# Altium schematic sheet 超级系统核心原理图.SchDoc
size A3
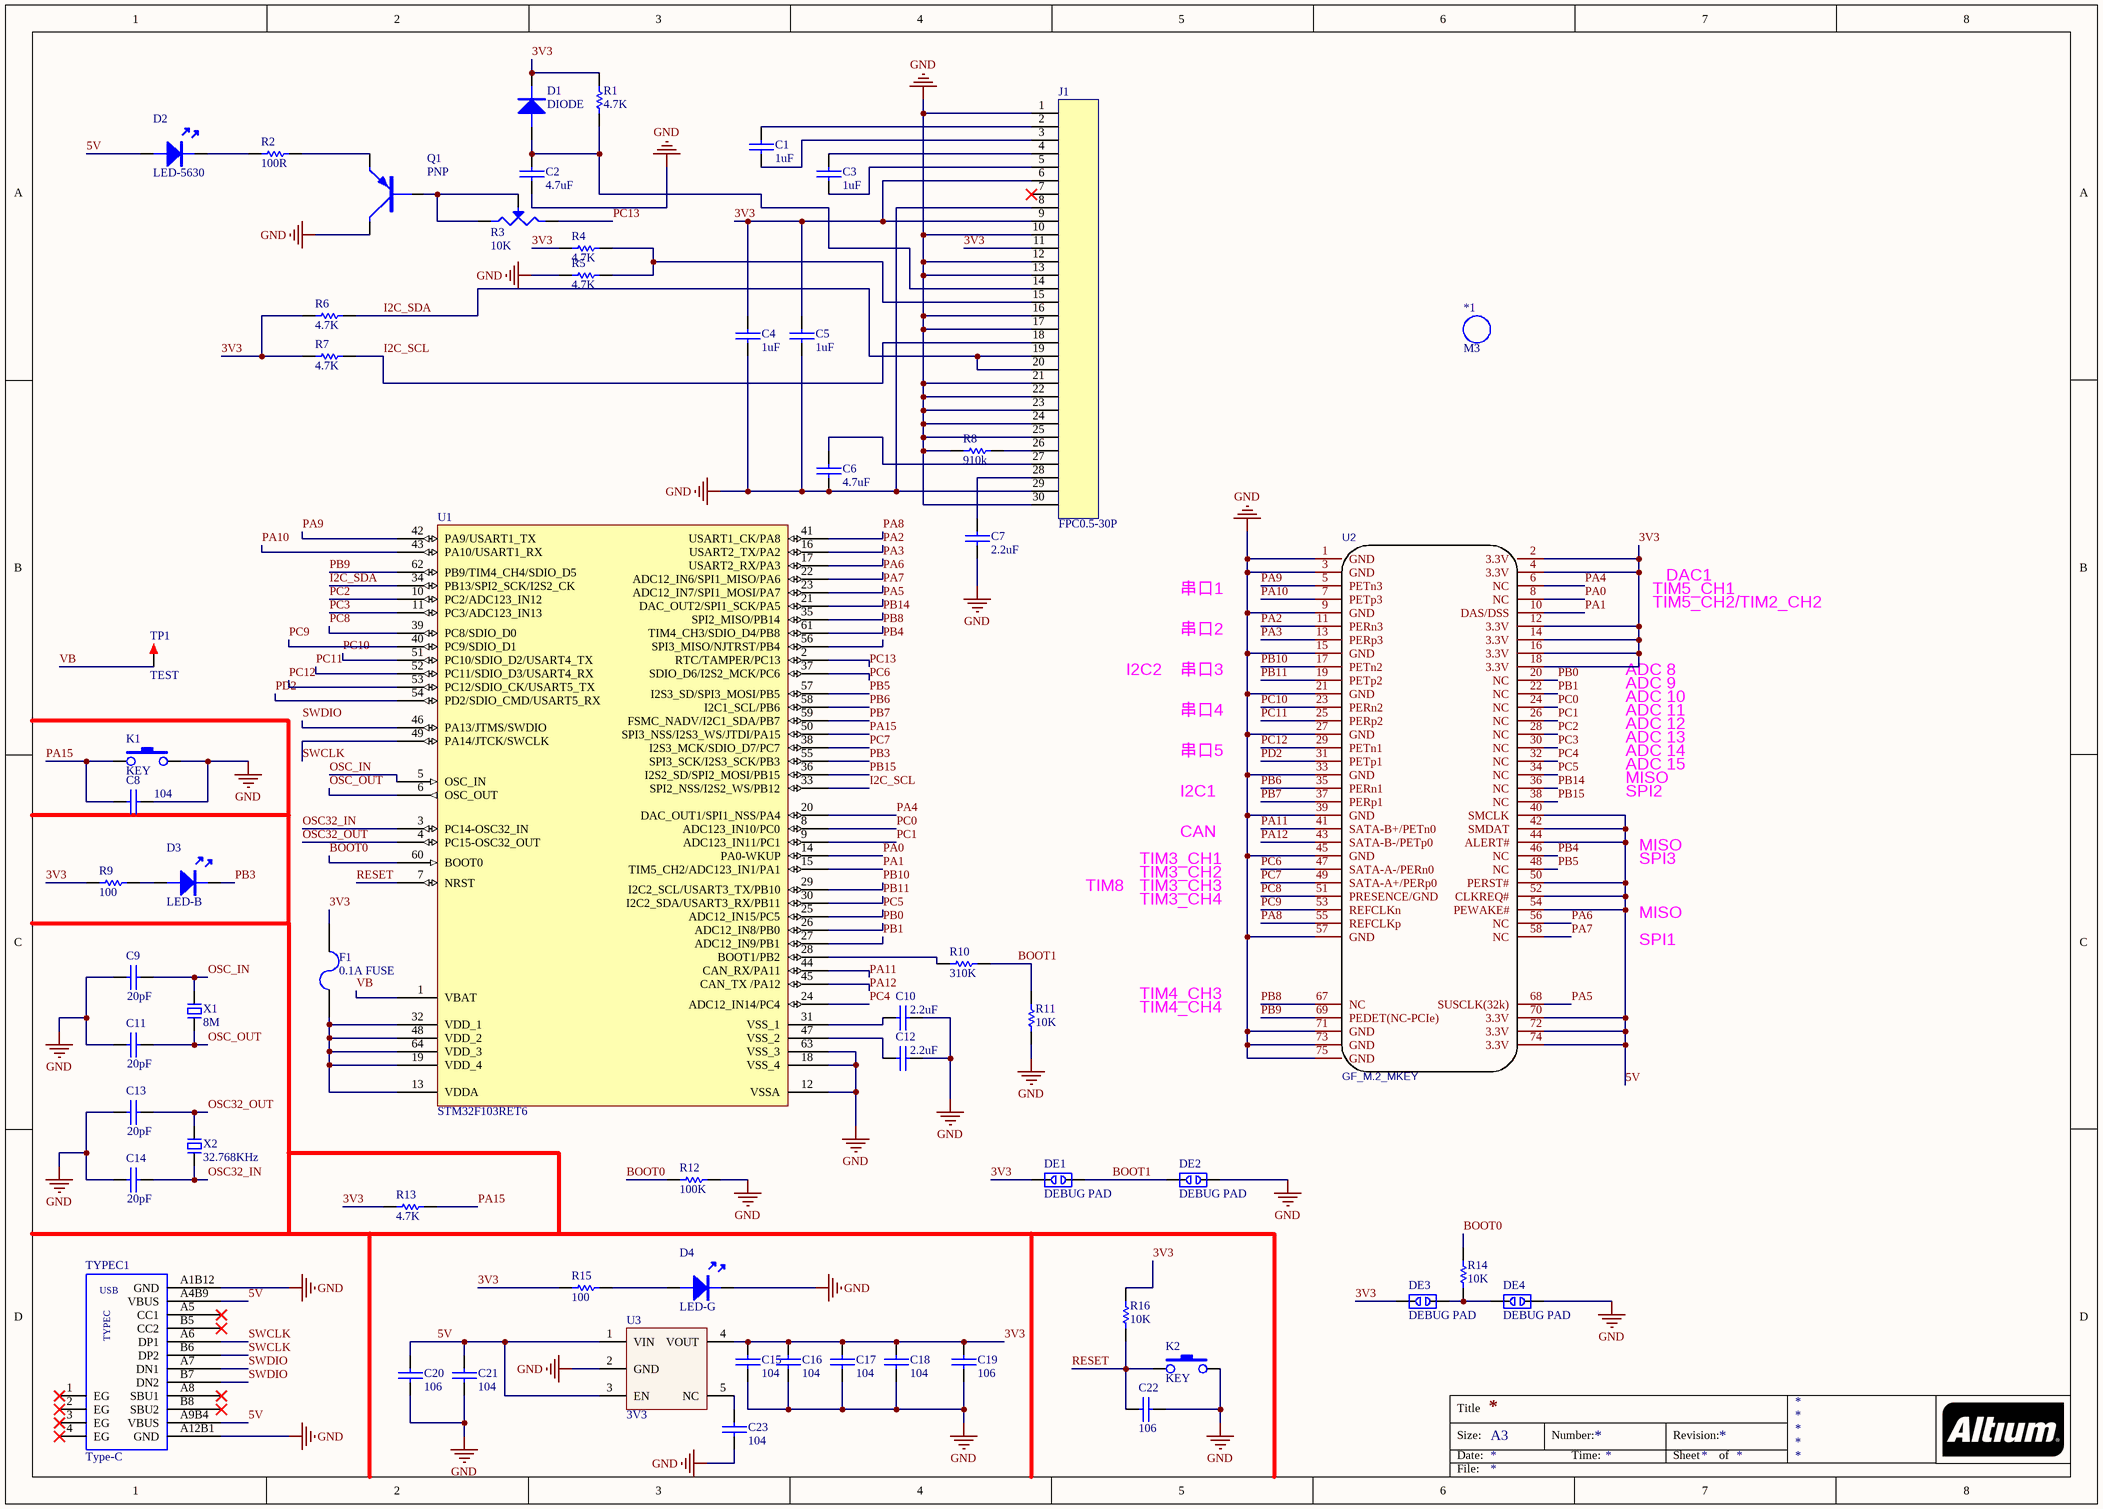
[diagram p0: 超级系统核心原理图.SchDoc]

## Parts
*1  M3  [M3 140X350]
C1  1uF  [0603C]
C2  4.7uF  [0603C]
C3  1uF  [0603C]
C4  1uF  [0603C]
C5  1uF  [0603C]
C6  4.7uF  [0603C]
C7  2.2uF  [0603C]
C8  104  [0603C]
C9  20pF  [0603C]
C10  2.2uF  [0603C]
C11  20pF  [0603C]
C12  2.2uF  [0603C]
C13  20pF  [0603C]
C14  20pF  [0603C]
C15  104  [0603C]
C16  104  [0603C]
C17  104  [0603C]
C18  104  [0603C]
C19  106  [0805C]
C20  106  [0805C]
C21  104  [0603C]
C22  106  [0805C]
C23  104  [0603C]
D1  DIODE  [SOD-523]
D2  LED-5630  [LED-5630W]
D3  LED-B  [LED-0603B]
D4  LED-G  [LED-0603G]
DE1  DEBUG PAD  [DEBUG_B]
DE2  DEBUG PAD  [DEBUG_B]
DE3  DEBUG PAD  [DEBUG_B]
DE4  DEBUG PAD  [DEBUG_B]
F1  0.1A FUSE  [0805R]
J1  FPC0.5-30P  [FPC0.5-30P]
K1  KEY  [SMD-4X4X1.5]
K2  KEY  [2X3X0.6]
Q1  PNP  [SOT-23]
R1  4.7K  [0603R]
R2  100R  [0603R]
R3  10K  [3303W]
R4  4.7K  [0603R]
R5  4.7K  [0603R]
R6  4.7K  [0603R]
R7  4.7K  [0603R]
R8  910k  [0603R]
R9  100  [0603R]
R10  310K  [0603R]
R11  10K  [0603R]
R12  100K  [0603R]
R13  4.7K  [0603R]
R14  10K  [0603R]
R15  100  [0603R]
R16  10K  [0603R]
TP1  TEST  [TEST 1.4]
TYPEC1  Type-C  [TYPE-C]
U1  STM32F103RET6  [LQFP64 10x10_L]
U2  GF_M.2_MKEY  [GF_M.2_M_KEY]
U3  3V3  [HX9193]
X1  8M  [OSC 5032-2P]
X2  32.768KHz  [OSC 3215-2P]

## Nets
GND: C2.1 C4.1 C5.1 C6.1 C7.1 C8.1 C9.1 C10.2 C11.1 C12.2 C13.1 C14.1 C15.1 C16.1 C17.1 C18.1 C19.1 C20.1 C21.1 C22.1 C23.1 D4.K DE2.2 DE4.2 J1.1 J1.8 J1.10 J1.12 J1.13 J1.16 J1.17 J1.21 J1.22 J1.23 J1.24 J1.25 J1.29 J1.30 K1.3 K2.3 Q1.C R5.2 R8.2 R11.2 R12.1 TYPEC1.A1B12(GND) TYPEC1.A12B1(GND) U1.12(VSSA) U1.18(VSS_4) U1.63(VSS_3) U2.1(GND) U2.3(GND) U2.9(GND) U2.15(GND) U2.21(GND) U2.27(GND) U2.33(GND) U2.39(GND) U2.45(GND) U2.57(GND) U2.71(GND) U2.73(GND) U2.75(GND) U3.2(GND)
3V3: C4.2 C5.2 C15.2 C16.2 C17.2 C18.2 C19.2 D1.K DE1.1 DE3.1 F1.2 J1.6 J1.9 J1.11 R1.1 R4.2 R6.2 R7.2 R9.2 R13.2 R15.2 R16.2 U2.2(3.3V) U2.4(3.3V) U2.12(3.3V) U2.14(3.3V) U2.16(3.3V) U2.18(3.3V) U3.4(VOUT)
5V: C20.2 C21.2 D2.A TYPEC1.A4B9(VBUS) TYPEC1.A9B4(VBUS) U2.40(SMCLK) U2.42(SMDAT) U2.44(ALERT#) U2.50(PERST#) U2.52(CLKREQ#) U2.54(PEWAKE#) U2.70(3.3V) U2.72(3.3V) U2.74(3.3V) U3.1(VIN) U3.3(EN)
BOOT0: R12.2 R14.1 U1.60(BOOT0)
BOOT1: DE1.2 DE2.1 R10.1 R11.1
I2C_SCL: J1.18 R7.1 U1.33(SPI2_NSS/I2S2_WS/PB12)
I2C_SDA: J1.19 J1.20 R6.1 U1.34(PB13/SPI2_SCK/I2S2_CK)
OSC32_IN: C14.2 U1.3(PC14-OSC32_IN) X2.1
OSC32_OUT: C13.2 U1.4(PC15-OSC32_OUT) X2.2
OSC_IN: C9.2 U1.5(OSC_IN) X1.2
OSC_OUT: C11.2 U1.6(OSC_OUT) X1.1
PA0: U1.14(PA0-WKUP) U2.8(NC)
PA1: U1.15(TIM5_CH2/ADC123_IN1/PA1) U2.10(DAS/DSS)
PA2: U1.16(USART2_TX/PA2) U2.11(PERn3)
PA3: U1.17(USART2_RX/PA3) U2.13(PERp3)
PA4: U1.20(DAC_OUT1/SPI1_NSS/PA4) U2.6(NC)
PA5: U1.21(DAC_OUT2/SPI1_SCK/PA5) U2.68(SUSCLK(32k))
PA6: U1.22(ADC12_IN6/SPI1_MISO/PA6) U2.56(NC)
PA7: U1.23(ADC12_IN7/SPI1_MOSI/PA7) U2.58(NC)
PA8: U1.41(USART1_CK/PA8) U2.55(REFCLKp)
PA9: U1.42(PA9/USART1_TX) U2.5(PETn3)
PA10: U1.43(PA10/USART1_RX) U2.7(PETp3)
PA11: U1.44(CAN_RX/PA11) U2.41(SATA-B+/PETn0)
PA12: U1.45(CAN_TX_/PA12) U2.43(SATA-B-/PETp0)
PA15: C8.2 K1.1 R13.1 U1.50(SPI3_NSS/I2S3_WS/JTDI/PA15)
PB0: U1.26(ADC12_IN8/PB0) U2.20(NC)
PB1: U1.27(ADC12_IN9/PB1) U2.22(NC)
PB3: D3.K U1.55(SPI3_SCK/I2S3_SCK/PB3)
PB4: U1.56(SPI3_MISO/NJTRST/PB4) U2.46(NC)
PB5: U1.57(I2S3_SD/SPI3_MOSI/PB5) U2.48(NC)
PB6: U1.58(I2C1_SCL/PB6) U2.35(PERn1)
PB7: U1.59(FSMC_NADV/I2C1_SDA/PB7) U2.37(PERp1)
PB8: U1.61(TIM4_CH3/SDIO_D4/PB8) U2.67(NC)
PB9: U1.62(PB9/TIM4_CH4/SDIO_D5) U2.69(PEDET(NC-PCIe))
PB10: U1.29(I2C2_SCL/USART3_TX/PB10) U2.17(PETn2)
PB11: U1.30(I2C2_SDA/USART3_RX/PB11) U2.19(PETp2)
PB14: U1.35(SPI2_MISO/PB14) U2.36(NC)
PB15: U1.36(I2S2_SD/SPI2_MOSI/PB15) U2.38(NC)
PC0: U1.8(ADC123_IN10/PC0) U2.24(NC)
PC1: U1.9(ADC123_IN11/PC1) U2.26(NC)
PC2: U1.10(PC2/ADC123_IN12) U2.28(NC)
PC3: U1.11(PC3/ADC123_IN13) U2.30(NC)
PC4: U1.24(ADC12_IN14/PC4) U2.32(NC)
PC5: U1.25(ADC12_IN15/PC5) U2.34(NC)
PC6: U1.37(SDIO_D6/I2S2_MCK/PC6) U2.47(SATA-A-/PERn0)
PC7: U1.38(I2S3_MCK/SDIO_D7/PC7) U2.49(SATA-A+/PERp0)
PC8: U1.39(PC8/SDIO_D0) U2.51(PRESENCE/GND)
PC9: U1.40(PC9/SDIO_D1) U2.53(REFCLKn)
PC10: U1.51(PC10/SDIO_D2/USART4_TX) U2.23(PERn2)
PC11: U1.52(PC11/SDIO_D3/USART4_RX) U2.25(PERp2)
PC12: U1.53(PC12/SDIO_CK/USART5_TX) U2.29(PETn1)
PC13: R3.2 U1.2(RTC/TAMPER/PC13)
PD2: U1.54(PD2/SDIO_CMD/USART5_RX) U2.31(PETp1)
RESET: C22.2 K2.1 R16.1 U1.7(NRST)
SWCLK: TYPEC1.A6(DP1) TYPEC1.B6(DP2) U1.49(PA14/JTCK/SWCLK)
SWDIO: TYPEC1.A7(DN1) TYPEC1.B7(DN2) U1.46(PA13/JTMS/SWDIO)
VB: TP1.1 U1.1(VBAT)
NetC1_1: C1.1 J1.3
NetC1_2: C1.2 J1.2
NetC2_2: C2.2 D1.A J1.14 R1.2
NetC3_1: C3.1 J1.5
NetC3_2: C3.2 J1.4
NetC6_2: C6.2 J1.27
NetC7_2: C7.2 J1.28
NetC10_1: C10.1 U1.31(VSS_1)
NetC12_1: C12.1 U1.47(VSS_2)
NetC23_2: C23.2 U3.5(NC)
NetD2_K: D2.K R2.1
NetD3_A: D3.A R9.1
NetD4_A: D4.A R15.1
NetDE3_2: DE3.2 DE4.1 R14.2
NetF1_1: F1.1 U1.13(VDDA) U1.19(VDD_4) U1.32(VDD_1) U1.48(VDD_2) U1.64(VDD_3)
NetJ1_15: J1.15 R4.1 R5.1
NetJ1_26: J1.26 R8.1
NetQ1_B: Q1.B R3.1 R3.3(W)
NetQ1_E: Q1.E R2.2
NetR10_2: R10.2 U1.28(BOOT1/PB2)

Not connected (* = marked no-connect by the designer): J1 7*; TYPEC1 1(EG)* 2(EG)* 3(EG)* 4(EG)* A5(CC1)* A8(SBU1)* B5(CC2)* B8(SBU2)*

## Notes on the sheet
- DAC1
- 串口1
- 串口2
- TIM5_CH1
- TIM5_CH2/TIM2_CH2
- I2C2
- 串口3
- 串口4
- ADC 10
- ADC 11
- ADC 8
- ADC 9
- 串口5
- ADC 14
- ADC 12
- ADC 13
- ADC 15
- MISO
- I2C1
- CAN
- SPI2
- TIM8
- TIM3_CH3
- TIM3_CH4
- TIM3_CH1
- TIM3_CH2
- SPI3
- SPI1
- TIM4_CH3
- TIM4_CH4
- Title
- Size:
- Date:
- A3
- Number:
- Time:
- Revision:
- Sheet
- of
- File:
- (in symbol Type-C) USB; TYPEC

## Library data of the parts
*1 = M3: 铜柱孔; 版权归属: 源创客; BOM名称: 铜柱孔; 学习资源: www.ooocke.com
C1-C23 = CAP: 无极性电容
D1 = DIODE: 普通二极管
D3 D4 = LED
DE1-DE4 = DEBUG: 调试断点焊盘; 版权归属: 源创客; BOM名称: 调试断点焊盘; 学习资源: www.ooocke.com
F1 = FUSE
J1 = FPC0.5-30P: 贴片
K2 = KEY: 薄膜按键
Q1 = PNP: PNP三极管
R1 R2 R4-R16 = RES
R3 = 电位器2
TP1 = TEST: 测试点; 版权归属: 源创客; BOM名称: 测试点; 学习资源: www.ooocke.com
TYPEC1 = Type-C: typec 3.1半完整引脚
U2 = GF_M.2_MKEY: BOM_Manufacturer: SHOWNAME=F; Contributor: redgragon; BOM_Manufacturer Part: SHOWNAME=F; BOM_Supplier Part: SHOWNAME=F; BOM_Supplier: SHOWNAME=F; link: SHOWNAME=F; spicePre: U; spiceSymbolName: GF_M.2_MKEY
U3 = HX9193: 三端稳压
X1 X2 = XTAL-2P: 2脚无源脚晶振